# Altium schematic sheet 3V3_LDO.SchDoc
size A4; SheetNumber: 1; SheetTotal: 1
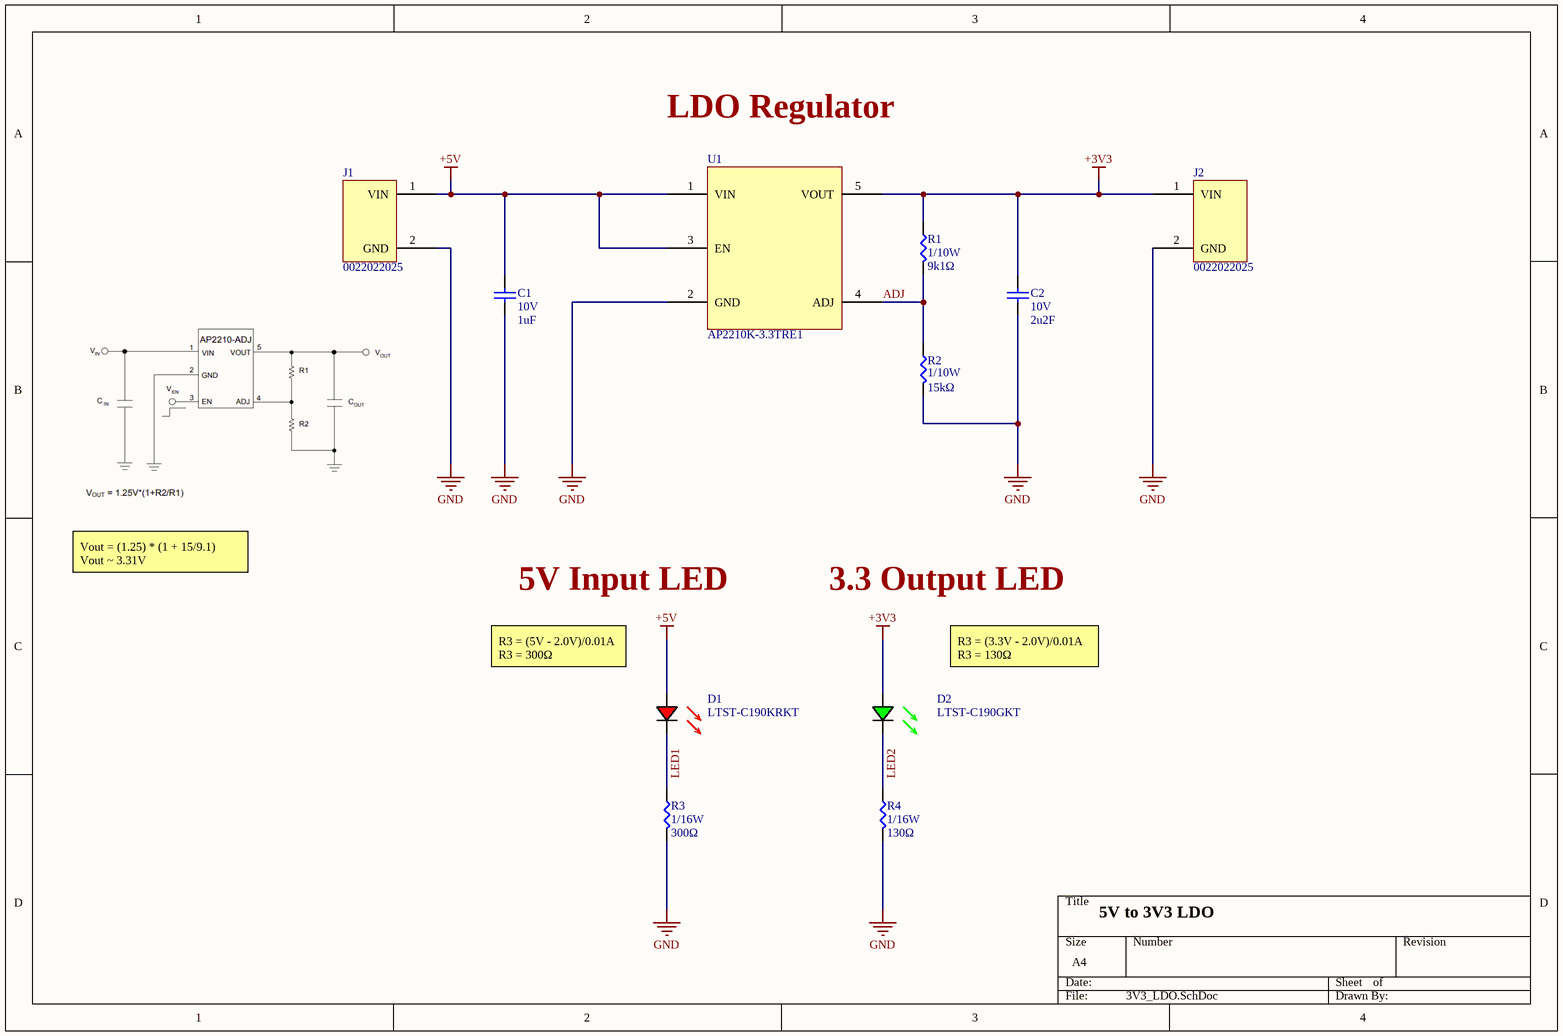
[diagram p0: 3V3_LDO.SchDoc]

## Parts
C1  value 1uF  Voltage Rating: 10V  [CAP0805]  (hidden comment: GRM188R61A105KA61D)
C2  value 2u2F  Voltage Rating: 10V  [CAP0805]  (hidden comment: GRM188R71A225KE15D)
D1  LTST-C190KRKT  [LED0603]
D2  LTST-C190GKT  [LED0603]
J1  0022022025  [0022022025]
J2  0022022025  [0022022025]
R1  value 9k1Ω  Power Rating: 1/10W  [RES0603]  (hidden comment: RC0603FR-079K1L)
R2  value 15kΩ  Rating: 1/10W  [RES0603]  (hidden comment: RC0603FR-0715KL)
R3  value 300Ω  Power Rating: 1/16W  [RES0603]  (hidden comment: RC0402JR-07300RL)
R4  value 130Ω  Power Rating: 1/16W  [RES0603]  (hidden comment: RC0402FR-07130RL)
U1  AP2210K-3.3TRE1  [AP2210K-3.3TRE1]

## Nets
+3V3: C2.2 D2.1 J2.1(VIN) R1.2 U1.5(VOUT)
+5V: C1.2 D1.1 J1.1(VIN) U1.1(VIN) U1.3(EN)
GND: C1.1 C2.1 J1.2(GND) J2.2(GND) R2.1 R3.1 R4.1 U1.2(GND)
ADJ: R1.1 R2.2 U1.4(ADJ)
LED1: D1.2 R3.2
LED2: D2.2 R4.2

## Notes on the sheet
- LDO Regulator
- Vout = (1.25) * (1 + 15/9.1)
  Vout ~ 3.31V
- 5V Input LED
- 3.3 Output LED
- R3 = (5V - 2.0V)/0.01A
  R3 = 300Ω
- R3 = (3.3V - 2.0V)/0.01A
  R3 = 130Ω
- 5V to 3V3 LDO

## Library data of the parts
C1 = GRM188R61A105KA61D: CAP CER 1UF 10V X5R 0603; Manufacturer 1: Murata; Supplier 1: Digi-Key; Manufacturer Part Number 1: GRM188R61A105KA61D; Supplier Part Number 1: 490-1543-2-ND
C2 = GRM188R71A225KE15D: CAP CER 2.2UF 10V X7R 0603; Manufacturer 1: Murata; Supplier 1: Digi-Key; Manufacturer Part Number 1: GRM188R71A225KE15D; Supplier Part Number 1: 490-4520-2-ND
D1 = LTST-C190KRKT: LED RED CLEAR CHIP SMD 0603; Manufacturer Part Number 1: 160-1436-2-ND; Supplier 1: Digikey; Supplier Part Number 1: 160-1436-2-ND; Manufacturer 1: LTST-C190KRKT
D2 = LTST-C190GKT: LED GREEN CLEAR CHIP SMD 0603; Manufacturer Part Number 1: 160-1436-2-ND; Supplier 1: Digikey; Supplier Part Number 1: 160-1183-1-ND; Manufacturer 1: LTST-C190GKT
J1 J2 = 0022022025: 2 Position Receptacle Connector 0.100" (2.54mm) Through Hole Tin; Manufacturer 1: MOLEX; Manufacturer Part Number 1: 0022022025; Supplier 1: DigiKey; Supplier Part Number 1: WM3200-ND
R1 = RC0603FR-079K1L: RES 9.1K OHM 1% 1/10W 0603; Manufacturer 1: YAGEO; Manufacturer Part Number 1: RC0603FR-079K1L; Supplier 1: Digi-Key; Supplier Part Number: 311-9.10KHRTR-ND
R2 = RC0603FR-0715KL: RES 15K OHM 1% 1/10W 0603; Manufacturer 1: Stackpole Electronics Inc; Manufacturer Part Number 1: RNCP0603FTD10K0; Manufacturer: YAGEO; Supplier Part Number 1: RNCP0603FTD10K0CT-ND; Supplier 1: Digi-Key; Supplier: DigiKey; Supplier Part Number: 311-9.10KHRTR-ND
R3 = RC0402JR-07300RL: RES 300 OHM 5% 1/16W 0402; Manufacturer 1: YAGEO; Manufacturer Part Number 1: RC0402JR-07300RL; Supplier 1: Digi-Key; Supplier Part Number: 311-300JRTR-ND
R4 = RC0402FR-07130RL: RES 130 OHM 1% 1/16W 0402; Manufacturer 1: YAGEO; Manufacturer Part Number 1: RC0402FR-07130RL; Supplier 1: Digi-Key; Supplier Part Number: 311-130LRTR-ND
U1 = AP2210K-3.3TRE1: IC REG LINEAR 3.3V 300MA SOT23-5; Manufacture 1: Diodes Incorporated; Manufacture Part Number 1: AP2210K-3.3TRE1; Supplier Part Number 1: 31-AP2210K-3.3TRE1CT-ND; Supplier 1: DigiKey